# Altium schematic sheet Pinout_DevKitC_Sch.SchDoc
size A4
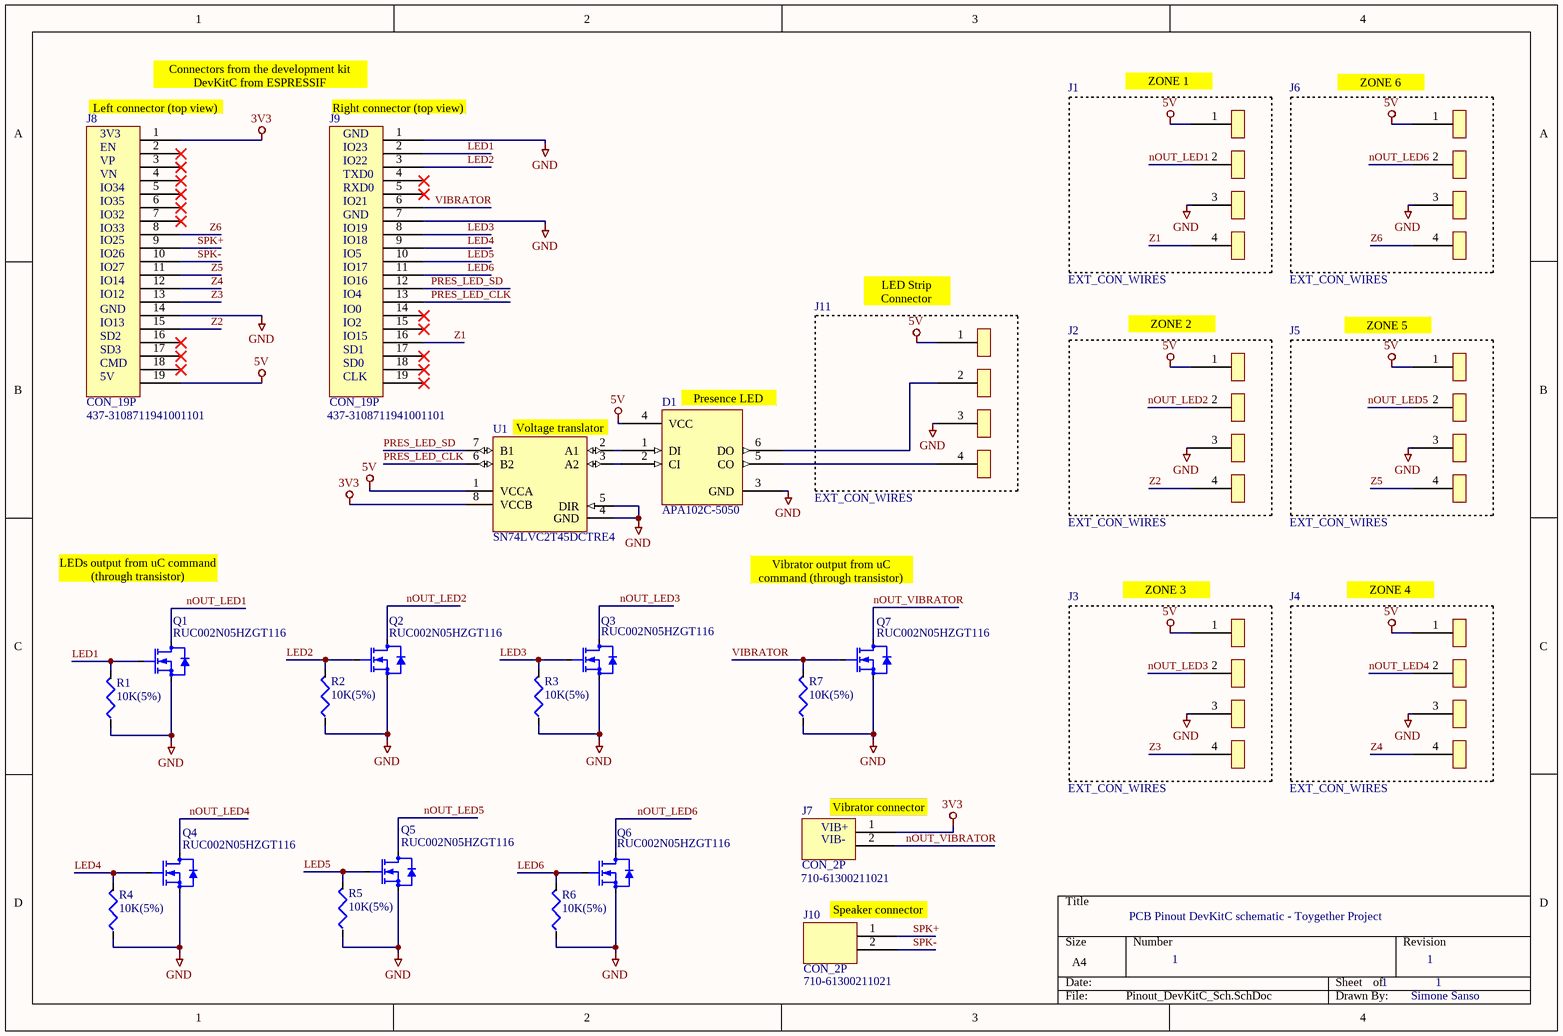
[diagram p0: Pinout_DevKitC_Sch.SchDoc]

## Parts
D1  APA102C-5050  [APA102C-5050]
J1  EXT_CON_WIRES  [EXT_CON_WIRES_4P]
J2  EXT_CON_WIRES  [EXT_CON_WIRES_4P]
J3  EXT_CON_WIRES  [EXT_CON_WIRES_4P]
J4  EXT_CON_WIRES  [EXT_CON_WIRES_4P]
J5  EXT_CON_WIRES  [EXT_CON_WIRES_4P]
J6  EXT_CON_WIRES  [EXT_CON_WIRES_4P]
J7  CON_2P  Supplier Part Number 1: 710-61300211021  [CON_2P]
J8  CON_19P  Supplier Part Number 1: 437-3108711941001101  [CON_19P]
J9  CON_19P  Supplier Part Number 1: 437-3108711941001101  [CON_19P]
J10  CON_2P  Supplier Part Number 1: 710-61300211021  [CON_2P]
J11  EXT_CON_WIRES  [EXT_CON_WIRES_4P]
Q1  RUC002N05HZGT116  [MOS-N_RUC002N05]
Q2  RUC002N05HZGT116  [MOS-N_RUC002N05]
Q3  RUC002N05HZGT116  [MOS-N_RUC002N05]
Q4  RUC002N05HZGT116  [MOS-N_RUC002N05]
Q5  RUC002N05HZGT116  [MOS-N_RUC002N05]
Q6  RUC002N05HZGT116  [MOS-N_RUC002N05]
Q7  RUC002N05HZGT116  [MOS-N_RUC002N05]
R1  10K(5%)  [RC0603]
R2  10K(5%)  [RC0603]
R3  10K(5%)  [RC0603]
R4  10K(5%)  [RC0603]
R5  10K(5%)  [RC0603]
R6  10K(5%)  [RC0603]
R7  10K(5%)  [RC0603]
U1  SN74LVC2T45DCTRE4  [VOLTAGE_TRANSLATOR_3.3-5V]

## Nets
3V3: J7.1 J8.1 U1.8(VCCB)
5V: D1.4(VCC) J1.1 J2.1 J3.1 J4.1 J5.1 J6.1 J8.19 J11.1 U1.1(VCCA)
GND: D1.3(GND) J1.3 J2.3 J3.3 J4.3 J5.3 J6.3 J8.14 J9.1 J9.7 J11.3 Q1.2 Q2.2 Q3.2 Q4.2 Q5.2 Q6.2 Q7.2 R1.1 R2.1 R3.1 R4.1 R5.1 R6.1 R7.1 U1.4(GND) U1.5(DIR)
LED1: J9.2 Q1.1 R1.2
LED2: J9.3 Q2.1 R2.2
LED3: J9.8 Q3.1 R3.2
LED4: J9.9 Q4.1 R4.2
LED5: J9.10 Q5.1 R5.2
LED6: J9.11 Q6.1 R6.2
nOUT_LED1: J1.2 Q1.3
nOUT_LED2: J2.2 Q2.3
nOUT_LED3: J3.2 Q3.3
nOUT_LED4: J4.2 Q4.3
nOUT_LED5: J5.2 Q5.3
nOUT_LED6: J6.2 Q6.3
nOUT_VIBRATOR: J7.2 Q7.3
PRES_LED_CLK: J9.13 U1.6(B2)
PRES_LED_SD: J9.12 U1.7(B1)
SPK+: J8.9 J10.1
SPK-: J8.10 J10.2
VIBRATOR: J9.6 Q7.1 R7.2
Z1: J1.4 J9.16
Z2: J2.4 J8.15
Z3: J3.4 J8.13
Z4: J4.4 J8.12
Z5: J5.4 J8.11
Z6: J6.4 J8.8
NetD1_1: D1.1(DI) U1.2(A1)
NetD1_2: D1.2(CI) U1.3(A2)
NetD1_5: D1.5(CO) J11.4
NetD1_6: D1.6(DO) J11.2

Not connected (* = marked no-connect by the designer): J8 2(1)* 3(1)* 4(1)* 5(1)* 6(1)* 7(1)* 16(1)* 17(1)* 18(1)*; J9 4(1)* 5(1)* 14(1)* 15(1)* 17(1)* 18(1)* 19(1)*

## Notes on the sheet
- (near J8) Left connector (top view)
- Connectors from the development kit DevKitC from ESPRESSIF
- (near J9) Right connector (top view)
- (near J1) ZONE 1
- (near J6) ZONE 6
- (near J8) 3V3
- (near J8) EN
- (near J8) VP
- (near J8) VN
- (near J9) GND
- (near J9) IO23
- (near J9) IO22
- (near J9) TXD0
- (near J8) IO34
- (near J8) IO35
- (near J8) IO32
- (near J8) IO33
- (near J8) IO25
- (near J9) RXD0
- (near J9) IO21
- (near J9) IO19
- (near J9) IO18
- (near J8) IO26
- (near J8) IO27
- (near J8) IO14
- (near J8) IO12
- (near J8) GND
- (near J9) IO5
- (near J9) IO17
- (near J9) IO16
- (near J9) IO4
- (near J9) IO0
- (near J11) LED Strip Connector
- (near J8) IO13
- (near J8) SD2
- (near J8) SD3
- (near J8) CMD
- (near J8) 5V
- (near J9) IO2
- (near J9) IO15
- (near J9) SD1
- (near J9) SD0
- (near J9) CLK
- (near J2) ZONE 2
- (near J5) ZONE 5
- (near U1) Voltage translator (3V3 -> 5V)
- (near D1) Presence LED
- LEDs output from uC command (through transistor)
- Vibrator output from uC command (through transistor)
- (near J3) ZONE 3
- (near J4) ZONE 4
- (near J7) VIB+
- (near J7) VIB-
- (near J7) Vibrator connector
- (near J10) Speaker connector
- PCB Pinout DevKitC schematic - Toygether Project
- 1
- Simone Sanso

## Library data of the parts
D1 = APA102C: Supplier 1: Mouser; Supplier Part Number 1: 474-COM-14863
J1-J6 J11 = EXT_CON_WIRES: Pads between pinout board and wires of the plush toy
J7 J10 = CON_2P: 2 Positions Header, Breakaway Connector 0.100" (2.54mm) Through Hole Tin; Supplier 1: Mouser
J8 J9 = CON_19P: 19 Positions Header, Breakaway Connector 0.100" (2.54mm) Through Hole Tin; Supplier 1: Mouser
Q1-Q7 = MOSFET_N-CH_RUC002N05HZGT116: RUC002N05HZGT116 (N-CH/50V/2.2R/200mA); Supplier 1: Mouser; Supplier Part Number 1: 755-RUC002N05HZGT116
R1-R7 = RES-10K(5%): RC0603JR-0710KL; Supplier 1: Mouser; Supplier Part Number 1: 603-RC0603JR-0710KL
U1 = VOLTAGE_TRANSLATOR_3.3-5V: Translation - Voltage Levels DUAL-BIT DUAL SUPPLY TRANSCEIVER; Supplier 1: Mouser; Supplier Part Number 1: 595-SN74LVC2T45DCTR